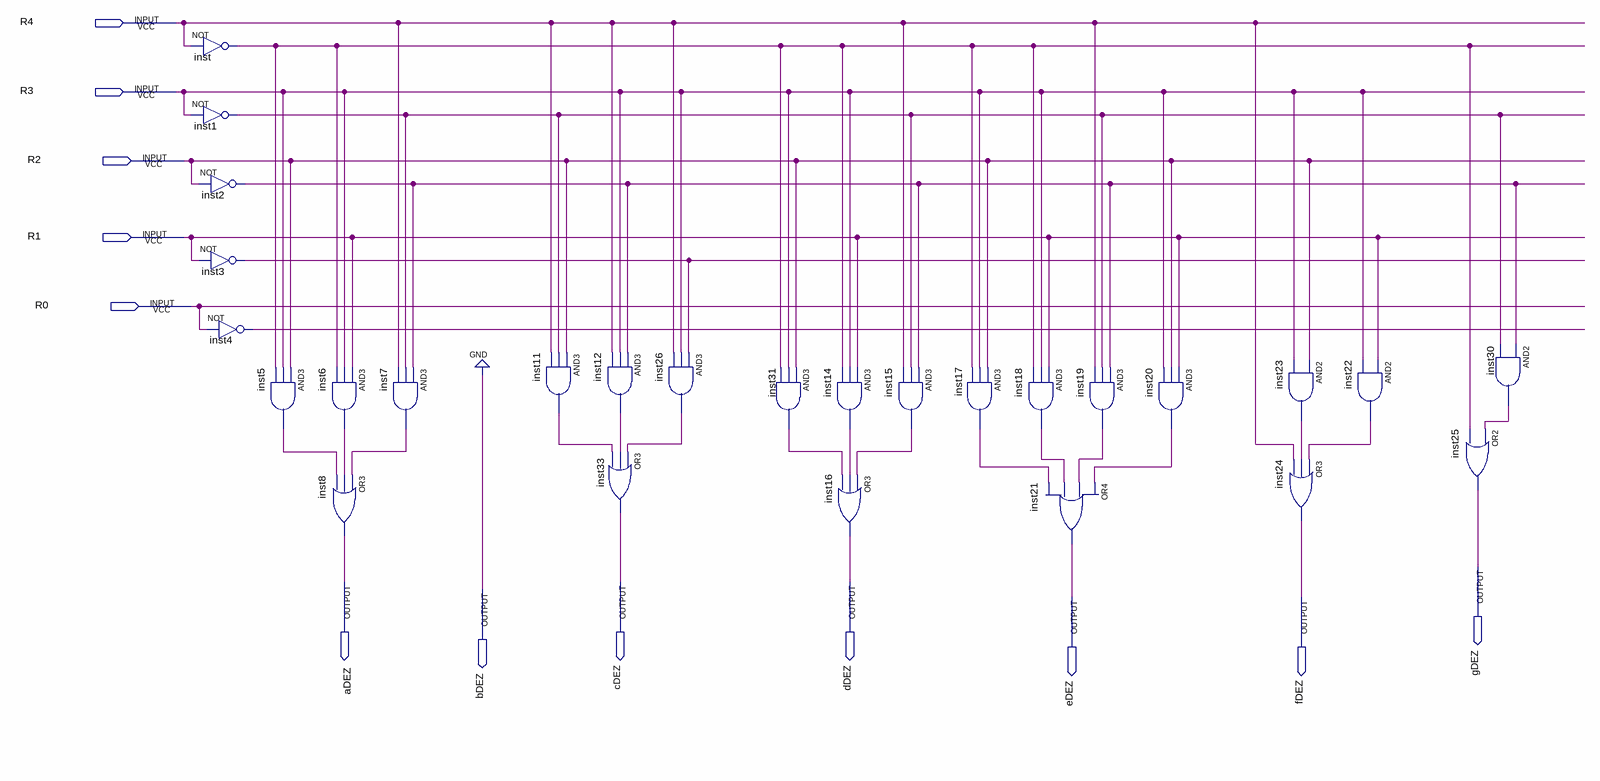
[diagram p0: schematic sheet]
// Quartus schematic decod7segDezena.bdf as structural Verilog: 27 symbols, 12 pins
module decod7segDezena (
  input  R4,
  input  R3,
  input  R2,
  input  R1,
  input  R0,
  output gDEZ,
  output aDEZ,
  output cDEZ,
  output dDEZ,
  output bDEZ,
  output eDEZ,
  output fDEZ
);

  wire inst1_out, inst2_out, inst3_out, inst4_out, inst5_out, inst6_out, inst7_out, inst11_out, inst12_out,
       inst14_out, inst15_out, inst17_out, inst18_out, inst19_out, inst20_out, inst22_out, inst23_out,
       inst26_out, inst30_out, inst31_out, inst_out;

  not inst (inst_out, R4);
  not inst1 (inst1_out, R3);
  not inst2 (inst2_out, R2);
  not inst3 (inst3_out, R1);
  not inst4 (inst4_out, R0);
  and inst5 (inst5_out, R2, R3, inst_out);
  and inst6 (inst6_out, R1, R3, inst_out);
  or inst8 (aDEZ, inst7_out, inst6_out, inst5_out);
  and inst7 (inst7_out, inst2_out, inst1_out, R4);
  and inst11 (inst11_out, R2, inst1_out, R4);
  and inst12 (inst12_out, inst2_out, R3, R4);
  or inst33 (cDEZ, inst26_out, inst12_out, inst11_out);
  and inst26 (inst26_out, inst3_out, R3, R4);
  and inst31 (inst31_out, R2, R3, inst_out);
  and inst14 (inst14_out, R1, R3, inst_out);
  or inst16 (dDEZ, inst15_out, inst14_out, inst31_out);
  and inst15 (inst15_out, inst2_out, inst1_out, R4);
  and inst17 (inst17_out, R2, R3, inst_out);
  and inst18 (inst18_out, R1, R3, inst_out);
  or inst21 (eDEZ, inst20_out, inst19_out, inst18_out, inst17_out);
  and inst19 (inst19_out, inst2_out, inst1_out, R4);
  and inst20 (inst20_out, R1, R2, R3);
  and inst23 (inst23_out, R2, R3);
  or inst24 (fDEZ, inst22_out, inst23_out, R4);
  and inst22 (inst22_out, R1, R3);
  or inst25 (gDEZ, inst30_out, inst_out);
  and inst30 (inst30_out, inst2_out, inst1_out);

  assign bDEZ = 1'b0;
endmodule
